# EAGLE design MRF24J10MA-mikroBUS-SIL (EAGLE 6.4)
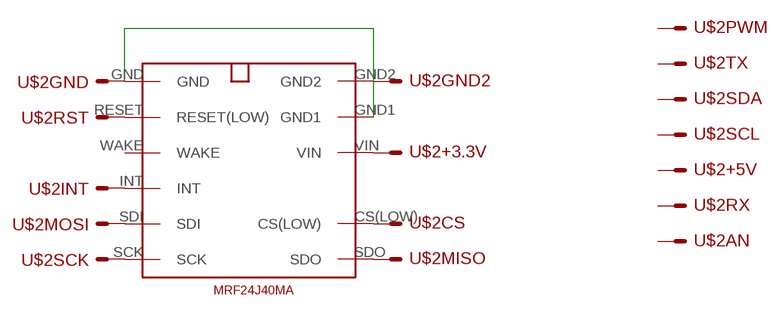
[diagram p0: schematic, sheet 1]

## Parts
U$1  MRF24J40MA  [MRF24J40MA]
U$2  MIKROBUSSIL  [MIKROBUS_SIL]

## Nets
N$3: U$1.RESET(RESET(LOW)) U$2.RST
N$4: U$1.INT U$2.INT
N$5: U$1.CS(LOW) U$2.CS
N$6: U$1.SCK U$2.SCK
N$7: U$1.SDO U$2.MISO
N$8: U$1.SDI U$2.MOSI
N$9: U$1.VIN U$2.+3.3V
N$10: U$1.GND U$1.GND1 U$1.GND2 U$2.GND U$2.GND2
Unconnected: U$1.WAKE U$2.+5V U$2.AN U$2.PWM U$2.RX U$2.SCL U$2.SDA U$2.TX

## Library data of the parts
U$1 = MRF24J40MA (1):MRF24J40MA
U$2 = lieven:MIKROBUS

## Board
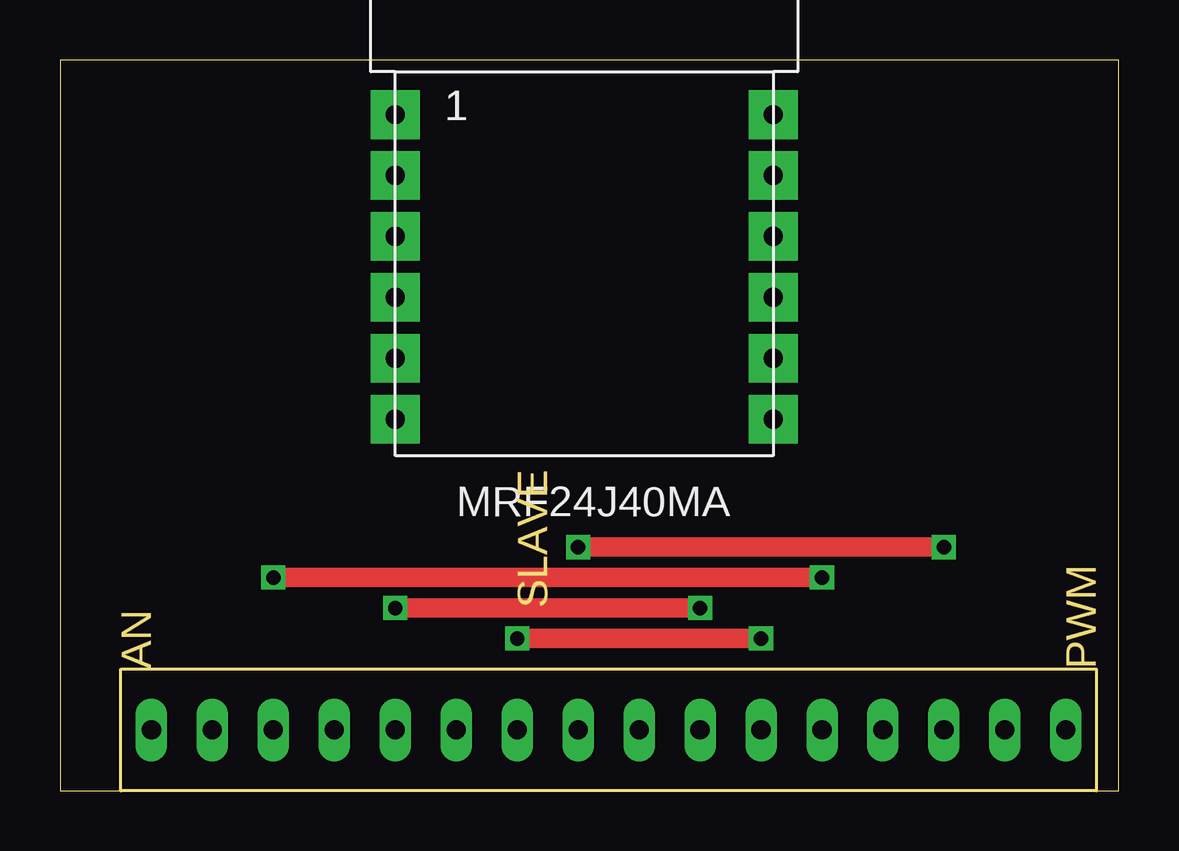
[diagram p1: board, top side]
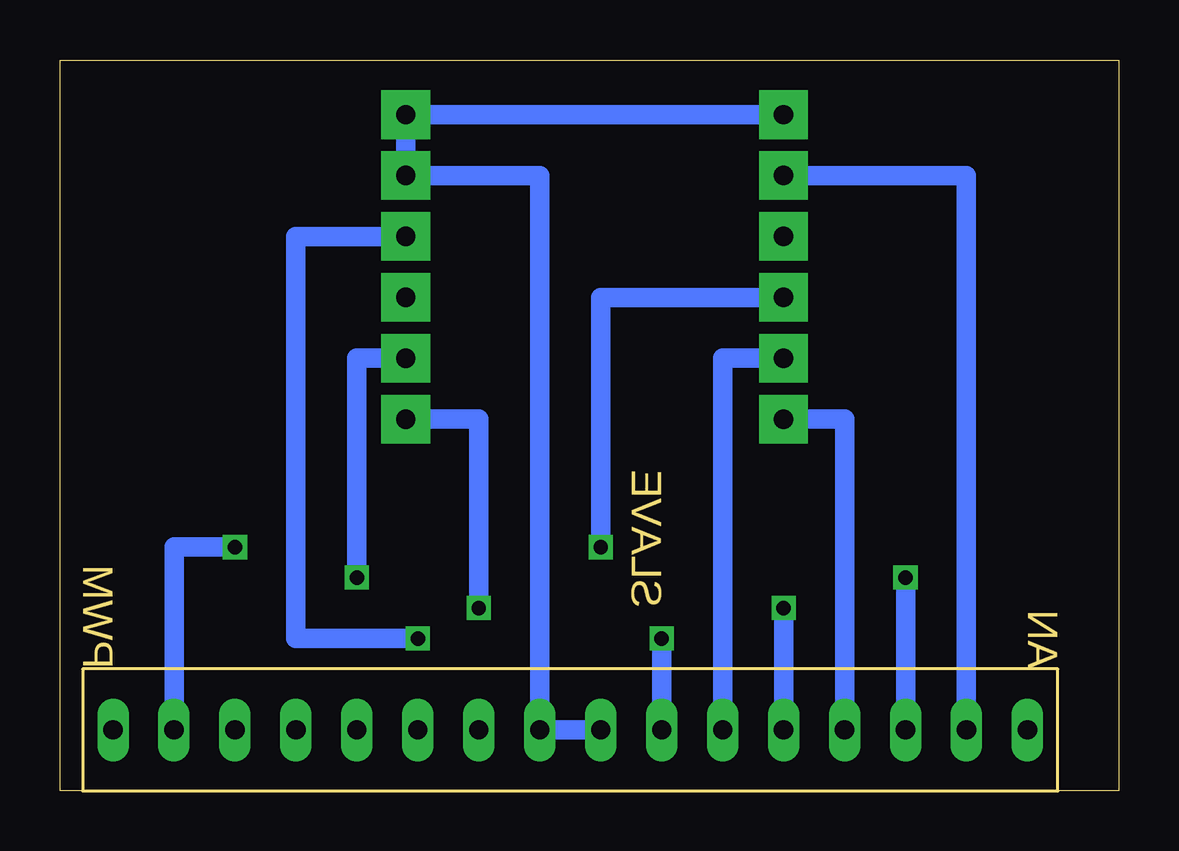
[diagram p2: board, bottom side, seen from below]

Size 44.12 x 30.47 mm. Coordinates in mm from the lower left corner, seen from the top.
Outline: 0,0 44.12,0 44.12,30.47 0,30.47 0,0
Copper layers (1*16): Top 0.035mm / dielectric 1.5mm / Bottom 0.035mm
Design rules "default": minimum track width 10mil, minimum drill 24mil, track to track 8mil, track to pad 8mil, pad to pad 8mil, via to via 8mil, smd to smd 8mil, copper to edge 40mil, drill to drill 8mil, minimum pad ring 10mil, minimum via ring 8mil, stop-mask expansion 4mil, vias tented up to drill 0mil, thermal gap 10mil

### Footprints (pad centres in the part's own frame; a part is rotated, then mirrored left to right if it is on the bottom)
MRF24J40MA = drill 0.8 pad 2.032 square: CS(LOW) 15.748,4.064; GND 0,14.224; GND1 15.748,11.684; GND2 15.748,14.224; INT 0,6.604; NC 15.748,6.604; RESET 0,11.684; SCK 0,1.524; SDI 0,4.064; SDO 15.748,1.524; VIN 15.748,9.144; WAKE 0,9.144
MIKROBUS_SIL = drill 0.8 long: +3.3V 0,2.54; +5V 0,-5.08; AN 0,17.78; CS 0,12.7; GND 0,0; GND2 0,-2.54; INT 0,-17.78; MISO 0,7.62; MOSI 0,5.08; PWM 0,-20.32; RST 0,15.24; RX 0,-15.24; SCK 0,10.16; SCL 0,-10.16; SDA 0,-7.62; TX 0,-12.7

### Placement (x,y rotation side)
U$1  13.97,13.97 0 top
U$2  21.59,2.54 90 top

### Tracks (layer width: path | path; a pad name or v marks a point on that pad's centre or on a via)
N$3
  Bottom 0.813: U$1.RESET 6.35,25.65 U$2.RST
N$4  (via drill 0.6)
  Top 0.813: v21.59,10.16 v36.83,10.16
  Bottom 0.813: U$1.INT 21.59,20.57 v21.59,10.16 | v36.83,10.16 39.37,10.16 U$2.INT
N$5  (via drill 0.6)
  Top 0.813: v31.75,8.89 v8.89,8.89
  Bottom 0.813: U$1.CS(LOW) 31.75,18.03 v31.75,8.89 | v8.89,8.89 U$2.CS
N$6
  Bottom 0.813: U$1.SCK 11.43,15.49 U$2.SCK
N$7  (via drill 0.6)
  Top 0.813: v26.67,7.62 v13.97,7.62
  Bottom 0.813: U$1.SDO 26.67,15.49 v26.67,7.62 | v13.97,7.62 U$2.MISO
N$8
  Bottom 0.813: U$1.SDI 16.51,18.03 U$2.MOSI
N$9  (via drill 0.6)
  Top 0.813: v29.21,6.35 v19.05,6.35
  Bottom 0.813: U$1.VIN 34.29,23.11 34.29,6.35 v29.21,6.35 | v19.05,6.35 U$2.+3.3V
N$10
  Bottom 0.813: U$1.GND U$1.GND2 U$1.GND1 24.13,25.65 U$2.GND2 U$2.GND